# EAGLE schematic DSO_A_AFE_1.66c (EAGLE 7.7.0)

## Sheet 1 of 4
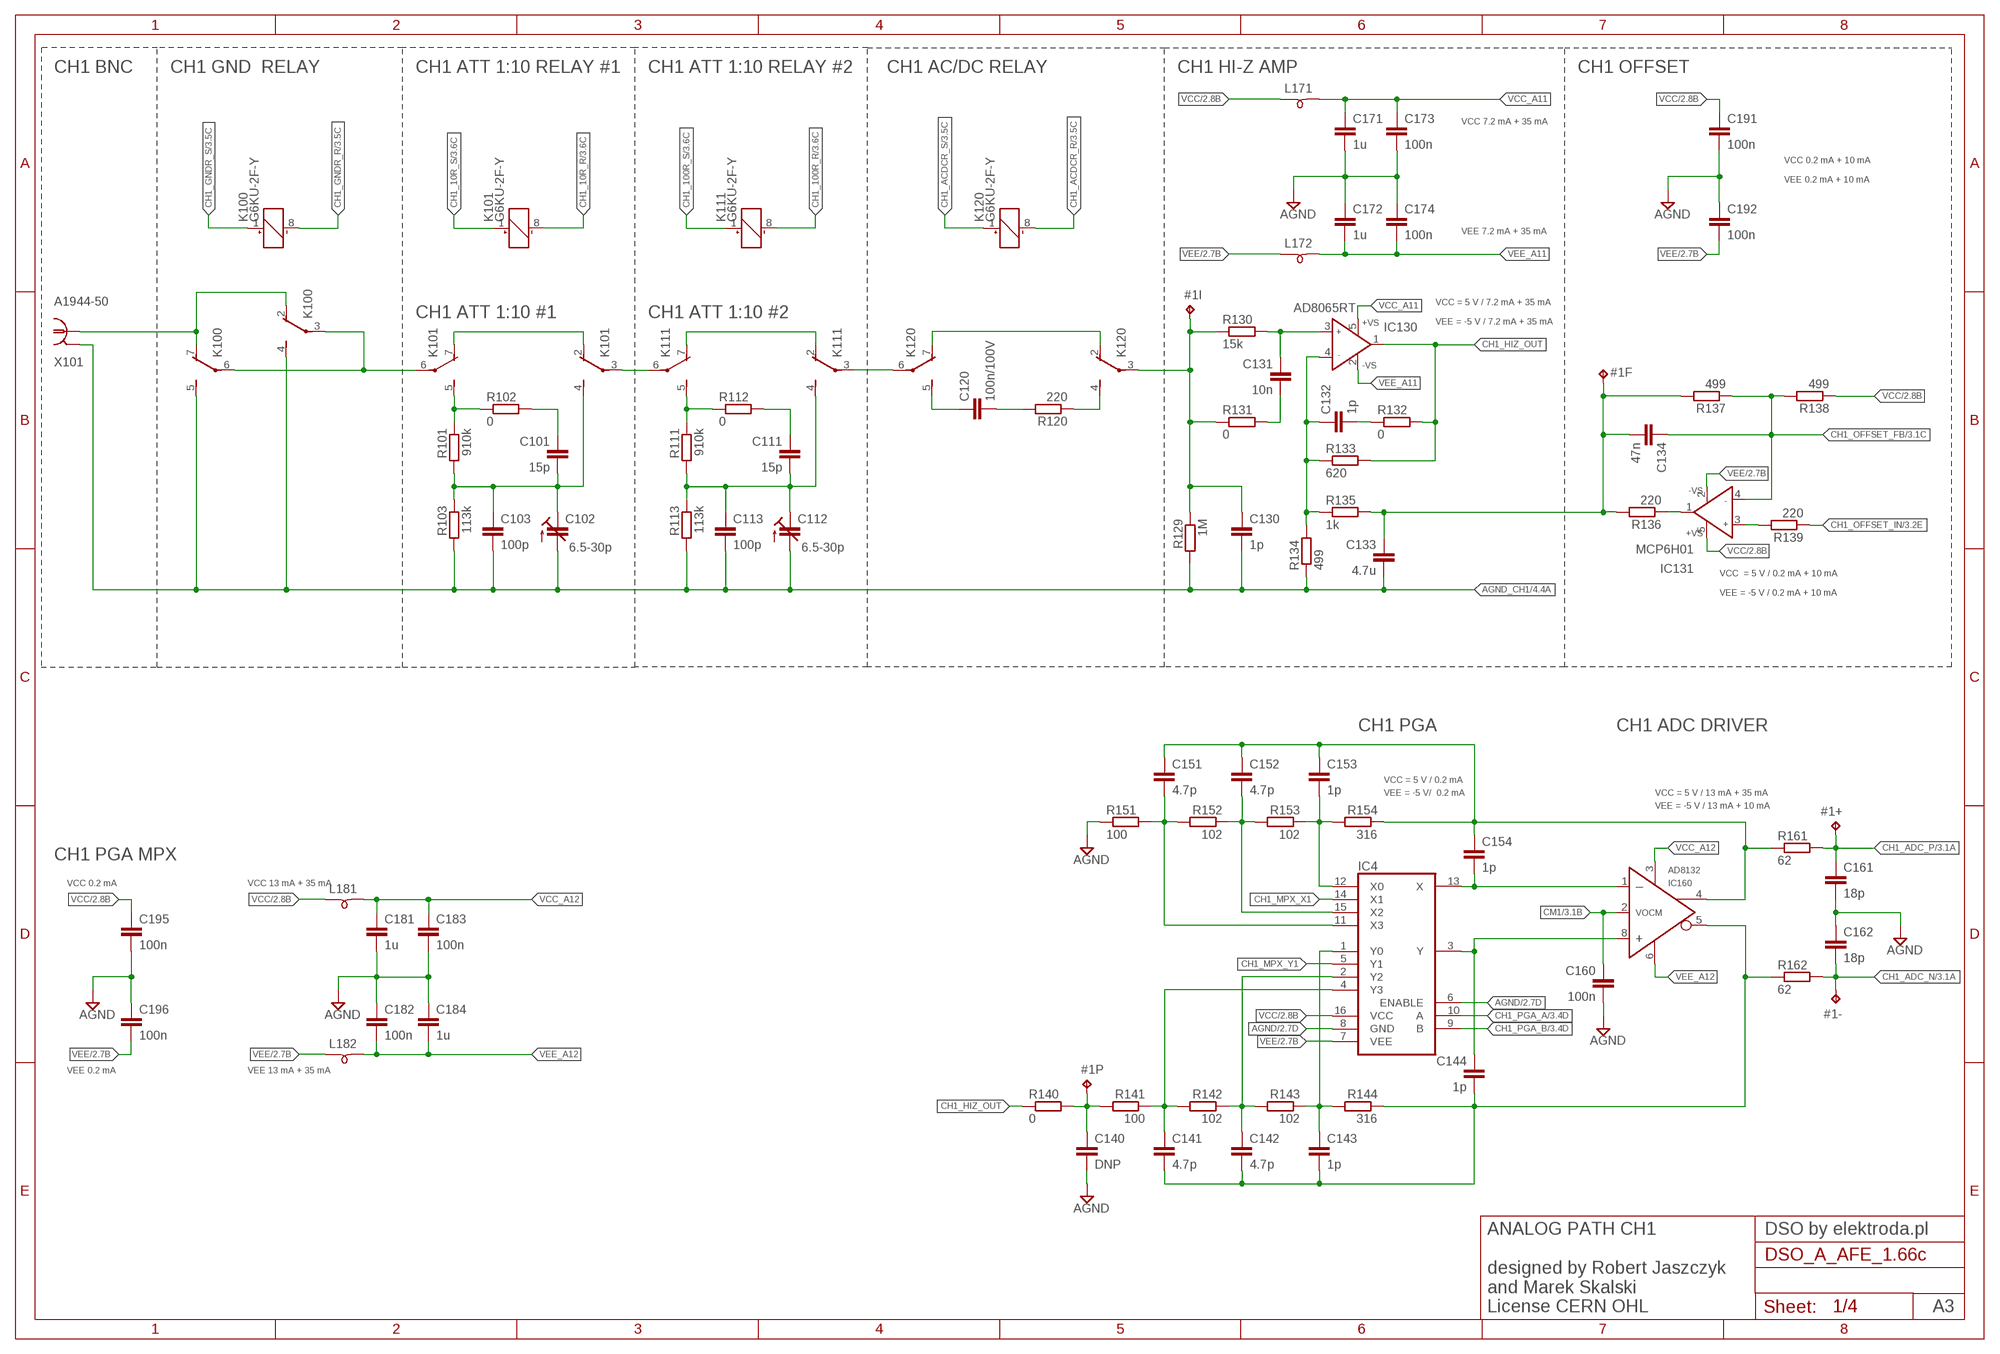
[diagram p0: schematic, sheet 1]

### Parts
#1+  TPB1,27  [B1,27]
#1-  TPB1,27  [B1,27]
#1F  TPB1,27  [B1,27]
#1I  TPB1,27  [B1,27]
#1P  TPB1,27  [B1,27]
C101  15p  C-EUC0603  [C0603]
C102  6.5-30p  C-TRIMMTZBX4  [CTRIMTZBX4]
C103  100p  C-EUC0603  [C0603]
C111  15p  C-EUC0603  [C0603]
C112  6.5-30p  C-TRIMMTZBX4  [CTRIMTZBX4]
C113  100p  C-EUC0603  [C0603]
C120  100n/100V  C-EUC1206  [C1206]
C130  1p  C-EUC0603  [C0603]
C131  10n  C-EUC0603  [C0603]
C132  1p  C-EUC0603  [C0603]
C133  4.7u  C-EUC0603  [C0603]
C134  47n  C-EUC0603  [C0603]
C140  DNP  C-EUC0603  [C0603]
C141  4.7p  C-EUC0603  [C0603]
C142  4.7p  C-EUC0603  [C0603]
C143  1p  C-EUC0603  [C0603]
C144  1p  C-EUC0603  [C0603]
C151  4.7p  C-EUC0603  [C0603]
C152  4.7p  C-EUC0603  [C0603]
C153  1p  C-EUC0603  [C0603]
C154  1p  C-EUC0603  [C0603]
C160  100n  C-EUC0603  [C0603]
C161  18p  C-EUC0603  [C0603]
C162  18p  C-EUC0603  [C0603]
C171  1u  C-EUC0603  [C0603]
C172  1u  C-EUC0603  [C0603]
C173  100n  C-EUC0603  [C0603]
C174  100n  C-EUC0603  [C0603]
C181  1u  C-EUC0603  [C0603]
C182  100n  C-EUC0603  [C0603]
C183  100n  C-EUC0603  [C0603]
C184  1u  C-EUC0603  [C0603]
C191  100n  C-EUC0603  [C0603]
C192  100n  C-EUC0603  [C0603]
C195  100n  C-EUC0603  [C0603]
C196  100n  C-EUC0603  [C0603]
IC4  DG4052EEQ  [TSSOP16]
IC130  AD8065RT  [SOT23-5]
IC131  MCP6H01  AD8065RT  [SOT23-5]
IC160  AD8132  [SO8]
K100  G6KU-2F-Y  [G6KU-2F-Y]
K101  G6KU-2F-Y  [G6KU-2F-Y]
K111  G6KU-2F-Y  [G6KU-2F-Y]
K120  G6KU-2F-Y  [G6KU-2F-Y]
L171  SM-B0603  [0603]
L172  SM-B0603  [0603]
L181  SM-B0603  [0603]
L182  SM-B0603  [0603]
R101  910k  R-EU_R0603  [R0603]
R102  0  R-EU_R0603  [R0603]
R103  113k  R-EU_R0603  [R0603]
R111  910k  R-EU_R0603  [R0603]
R112  0  R-EU_R0603  [R0603]
R113  113k  R-EU_R0603  [R0603]
R120  220  R-EU_R0603  [R0603]
R129  1M  R-EU_R0603  [R0603]
R130  15k  R-EU_R0603  [R0603]
R131  0  R-EU_R0603  [R0603]
R132  0  R-EU_R0603  [R0603]
R133  620  R-EU_R0603  [R0603]
R134  499  R-EU_R0603  [R0603]
R135  1k  R-EU_R0603  [R0603]
R136  220  R-EU_R0603  [R0603]
R137  499  R-EU_R0603  [R0603]
R138  499  R-EU_R0603  [R0603]
R139  220  R-EU_R0603  [R0603]
R140  0  R-EU_R0603  [R0603]
R141  100  R-EU_R0603  [R0603]
R142  102  R-EU_R0603  [R0603]
R143  102  R-EU_R0603  [R0603]
R144  316  R-EU_R0603  [R0603]
R151  100  R-EU_R0603  [R0603]
R152  102  R-EU_R0603  [R0603]
R153  102  R-EU_R0603  [R0603]
R154  316  R-EU_R0603  [R0603]
R161  62  R-EU_R0603  [R0603]
R162  62  R-EU_R0603  [R0603]
X101  A1944-50  [A1944]

### Nets
AGND: C140.2 C160.2 C161.2 C162.1 C171.2 C172.1 C173.2 C174.1 C181.2 C182.1 C183.2 C184.1 C191.2 C192.1 C195.2 C196.1 IC4.6(ENABLE) IC4.8(GND) R151.1 ; also sheet 2,4
AGND_CH1: C102.2(A) C103.2 C112.2(A) C113.2 C130.2 C133.2 K100.4(2:S) K100.5(3:S) R103.2 R113.2 R129.2 R134.1 X101.2 X101.3 X101.4 X101.5 ; also sheet 4
CH1_10R_R: K101.8(1:-) ; also sheet 3
CH1_10R_S: K101.1(1:+) ; also sheet 3
CH1_100R_R: K111.8(1:-) ; also sheet 3
CH1_100R_S: K111.1(1:+) ; also sheet 3
CH1_A1_C: C101.1 R102.2
CH1_A1_IN: K101.5(3:S) R101.1 R102.1
CH1_A1_OUT: C101.2 C102.1(E) C103.1 K101.4(2:S) R101.2 R103.1
CH1_A2_C: C111.1 R112.2
CH1_A2_IN: K111.5(3:S) R111.1 R112.1
CH1_A2_OUT: C111.2 C112.1(E) C113.1 K111.4(2:S) R111.2 R113.1
CH1_AC: C120.2 R120.2
CH1_ACDCR_R: K120.8(1:-) ; also sheet 3
CH1_ACDCR_S: K120.1(1:+) ; also sheet 3
CH1_ACI: C120.1 K120.5(3:S)
CH1_ACO: K120.4(2:S) R120.1
CH1_ADC_N: #1-.TP C162.2 R162.2 ; also sheet 3
CH1_ADC_P: #1+.TP C161.1 R161.2 ; also sheet 3
CH1_GNDR_R: K100.8(1:-) ; also sheet 3
CH1_GNDR_S: K100.1(1:+) ; also sheet 3
CH1_HIZ_IN: #1I.TP C130.1 K120.3(2:P) R129.1 R130.1 R131.1
CH1_HIZ_IN+: C131.1 IC130.3(IN+) R130.2
CH1_HIZ_IN-: C132.1 IC130.4(IN-) R133.1 R134.2 R135.1
CH1_HIZ_OUT: IC130.1(OUT) R132.2 R133.2 R140.1
CH1_IN: K100.2(2:O) K100.7(3:O) X101.1
CH1_IN01: K100.3(2:P) K100.6(3:P) K101.6(3:P)
CH1_IN12: K101.3(2:P) K111.6(3:P)
CH1_IN_HIZ_C: C131.2 R131.2
CH1_INA1: K101.2(2:O) K101.7(3:O)
CH1_INA2: K111.2(2:O) K111.7(3:O)
CH1_INA3: K120.2(2:O) K120.7(3:O)
CH1_INA23: K111.3(2:P) K120.6(3:P)
CH1_MPX_X1: IC4.14(X1)
CH1_MPX_Y1: IC4.5(Y1)
CH1_OFFSET: #1F.TP C133.1 C134.2 R135.2 R136.2 R137.2
CH1_OFFSET_FB: C134.1 IC131.4(IN-) R137.1 R138.2 ; also sheet 3
CH1_OFFSET_IN: R139.1 ; also sheet 3
CH1_OFS_IN+: IC131.3(IN+) R139.2
CH1_OFS_OUT_DIR: IC131.1(OUT) R136.1
CH1_OUT_C: C132.2 R132.1
CH1_PGA_A: IC4.10(A) ; also sheet 3
CH1_PGA_B: IC4.9(B) ; also sheet 3
CH1_PGA_IN: #1P.TP C140.1 R140.2 R141.2
CH1_PGA_IN+: C144.1 IC4.3(Y) IC160.8(+IN)
CH1_PGA_IN-: C154.2 IC4.13(X) IC160.1(-IN)
CH1_PGA_N1: C143.1 IC4.1(Y0) R143.1 R144.2
CH1_PGA_N2: C142.1 IC4.2(Y2) R142.1 R143.2
CH1_PGA_N3: C141.1 IC4.4(Y3) R141.1 R142.2
CH1_PGA_P1: C153.2 IC4.12(X0) R153.1 R154.2
CH1_PGA_P2: C152.2 IC4.15(X2) R152.1 R153.2
CH1_PGA_P3: C151.2 IC4.11(X3) R151.2 R152.2
CH1_PGA_P_DIR: C151.1 C152.1 C153.1 C154.1 IC160.4(+OUT) R154.1 R161.1
CH1_PGAN_DIR: C141.2 C142.2 C143.2 C144.2 IC160.5(-OUT) R144.1 R162.1
CM1: C160.1 IC160.2(VOCM) ; also sheet 3
VCC: C191.1 C195.1 IC4.16(VCC) IC131.5(+VS) L171.1 L181.1 R138.1 ; also sheet 2,3,4
VCC_A11: C171.1 C173.1 IC130.5(+VS) L171.2
VCC_A12: C181.1 C183.1 IC160.3(V+) L181.2
VEE: C192.2 C196.2 IC4.7(VEE) IC131.2(-VS) L172.1 L182.1 ; also sheet 2,4
VEE_A11: C172.2 C174.2 IC130.2(-VS) L172.2
VEE_A12: C182.2 C184.2 IC160.6(V-) L182.2

### Notes on the sheet
- CH1 BNC | CH1 GND  RELAY | CH1 ATT 1:10 RELAY #1 | CH1 ATT 1:10 RELAY #2 | CH1 AC/DC RELAY | CH1 HI-Z AMP | CH1 OFFSET
- VCC 7.2 mA + 35 mA
- VCC 0.2 mA + 10 mA
- VEE 0.2 mA + 10 mA
- VEE 7.2 mA + 35 mA
- VCC = 5 V / 7.2 mA + 35 mA
- CH1 ATT 1:10 #1 | CH1 ATT 1:10 #2
- VEE = -5 V / 7.2 mA + 35 mA
- VCC  = 5 V / 0.2 mA + 10 mA
- VEE = -5 V / 0.2 mA + 10 mA
- CH1 PGA | CH1 ADC DRIVER
- VCC = 5 V / 0.2 mA
- VEE = -5 V/  0.2 mA | VCC = 5 V / 13 mA + 35 mA
- VEE = -5 V / 13 mA + 10 mA
- CH1 PGA MPX
- VCC 0.2 mA | VCC 13 mA + 35 mA
- VEE 0.2 mA | VEE 13 mA + 35 mA
- DSO by elektroda.pl
- ANALOG PATH CH1
  
  designed by Robert Jaszczyk
  and Marek Skalski
  License CERN OHL
- A3

## Sheet 2 of 4
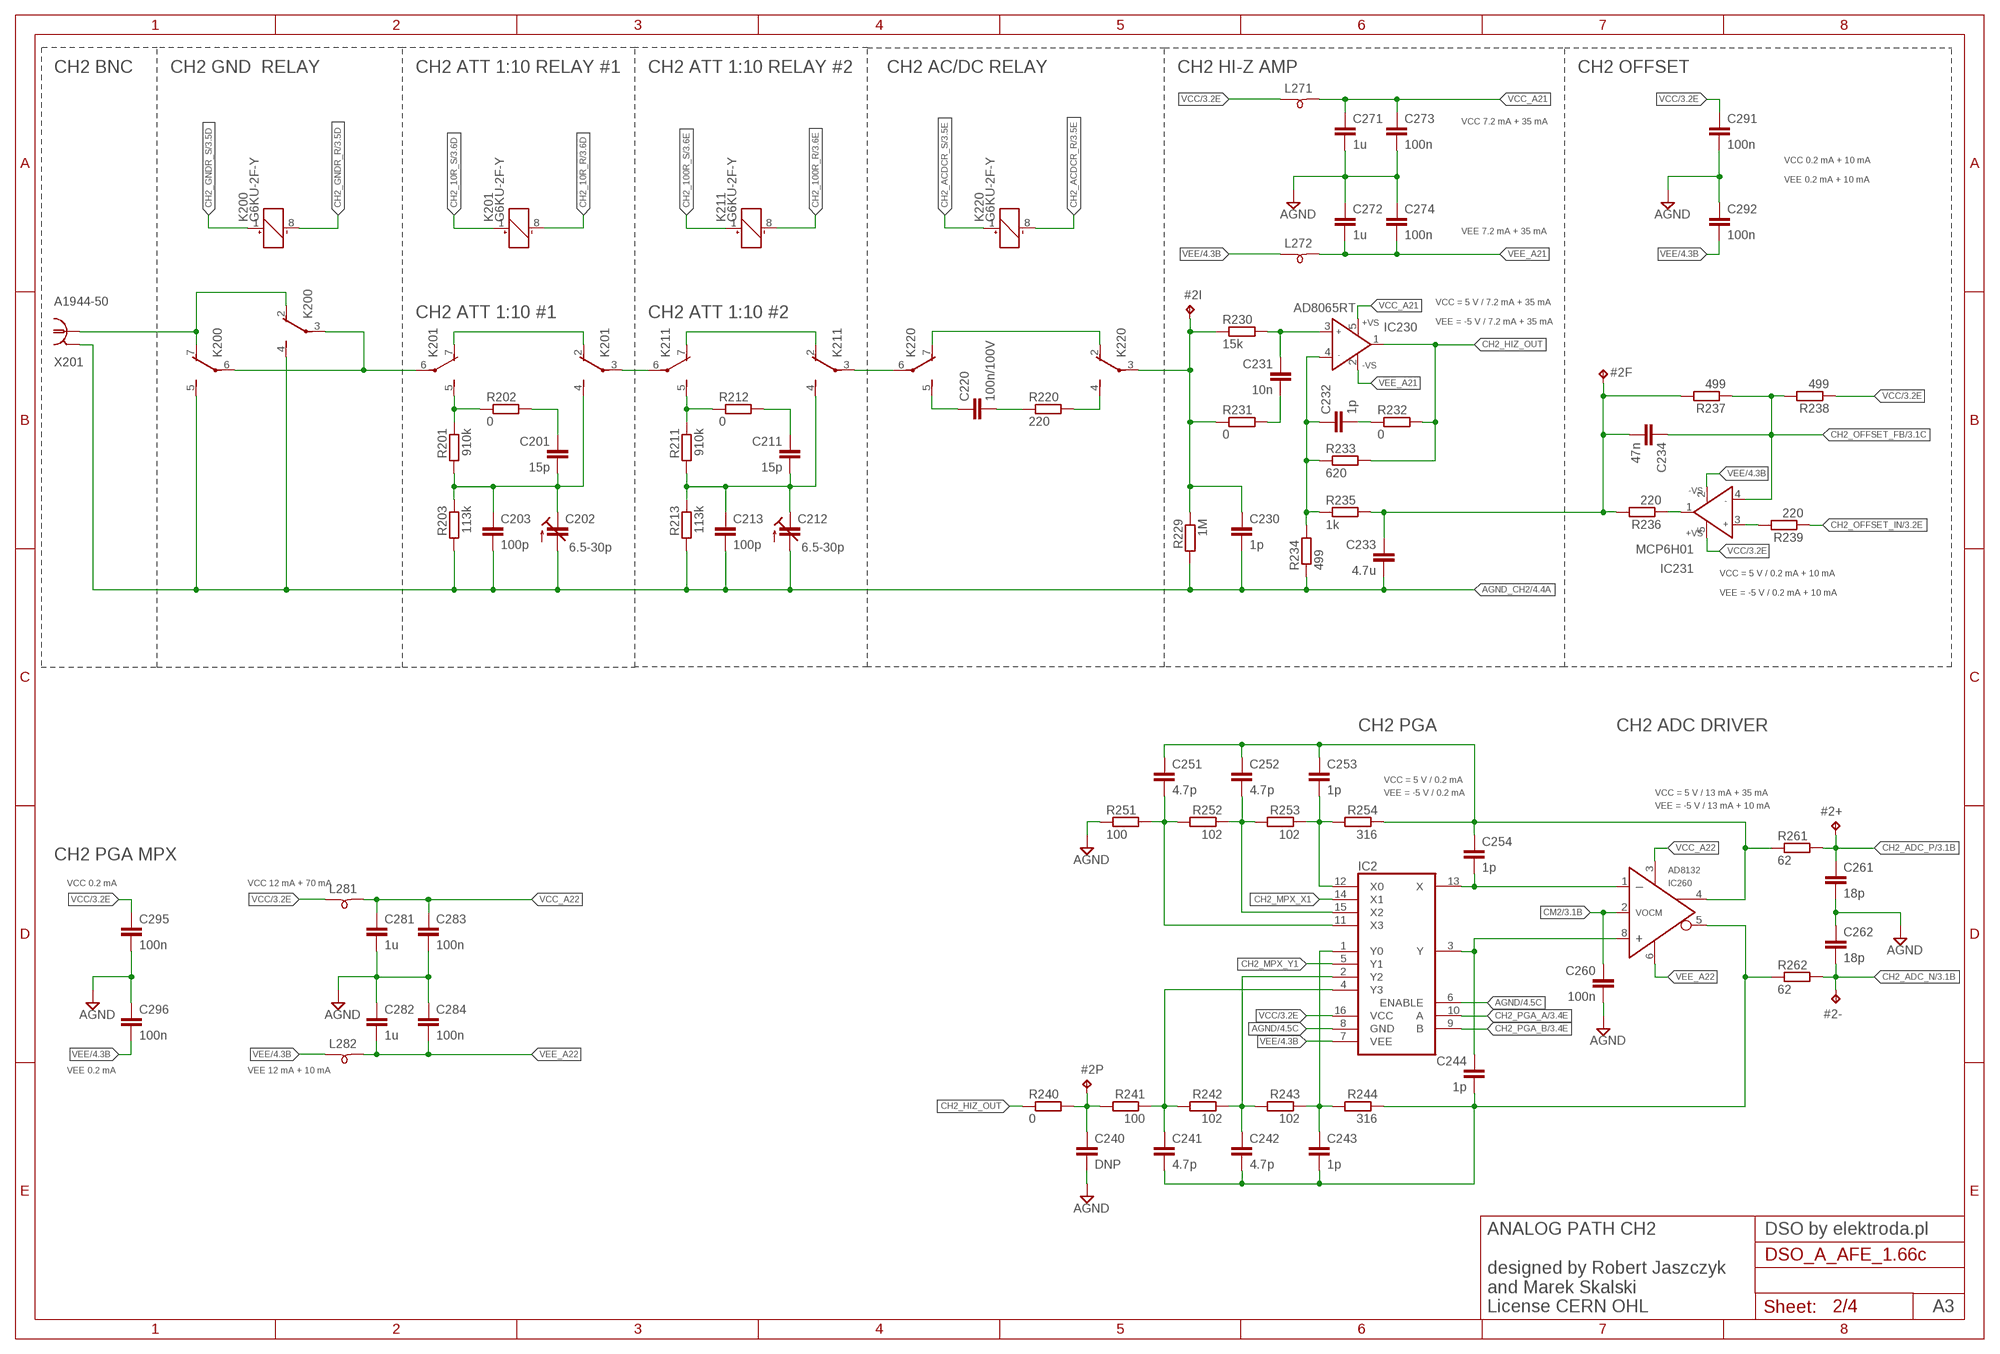
[diagram p1: schematic, sheet 2]

### Parts
#2+  TPB1,27  [B1,27]
#2-  TPB1,27  [B1,27]
#2F  TPB1,27  [B1,27]
#2I  TPB1,27  [B1,27]
#2P  TPB1,27  [B1,27]
C201  15p  C-EUC0603  [C0603]
C202  6.5-30p  C-TRIMMTZBX4  [CTRIMTZBX4]
C203  100p  C-EUC0603  [C0603]
C211  15p  C-EUC0603  [C0603]
C212  6.5-30p  C-TRIMMTZBX4  [CTRIMTZBX4]
C213  100p  C-EUC0603  [C0603]
C220  100n/100V  C-EUC1206  [C1206]
C230  1p  C-EUC0603  [C0603]
C231  10n  C-EUC0603  [C0603]
C232  1p  C-EUC0603  [C0603]
C233  4.7u  C-EUC0603  [C0603]
C234  47n  C-EUC0603  [C0603]
C240  DNP  C-EUC0603  [C0603]
C241  4.7p  C-EUC0603  [C0603]
C242  4.7p  C-EUC0603  [C0603]
C243  1p  C-EUC0603  [C0603]
C244  1p  C-EUC0603  [C0603]
C251  4.7p  C-EUC0603  [C0603]
C252  4.7p  C-EUC0603  [C0603]
C253  1p  C-EUC0603  [C0603]
C254  1p  C-EUC0603  [C0603]
C260  100n  C-EUC0603  [C0603]
C261  18p  C-EUC0603  [C0603]
C262  18p  C-EUC0603  [C0603]
C271  1u  C-EUC0603  [C0603]
C272  1u  C-EUC0603  [C0603]
C273  100n  C-EUC0603  [C0603]
C274  100n  C-EUC0603  [C0603]
C281  1u  C-EUC0603  [C0603]
C282  1u  C-EUC0603  [C0603]
C283  100n  C-EUC0603  [C0603]
C284  100n  C-EUC0603  [C0603]
C291  100n  C-EUC0603  [C0603]
C292  100n  C-EUC0603  [C0603]
C295  100n  C-EUC0603  [C0603]
C296  100n  C-EUC0603  [C0603]
IC2  DG4052EEQ  [TSSOP16]
IC230  AD8065RT  [SOT23-5]
IC231  MCP6H01  AD8065RT  [SOT23-5]
IC260  AD8132  [SO8]
K200  G6KU-2F-Y  [G6KU-2F-Y]
K201  G6KU-2F-Y  [G6KU-2F-Y]
K211  G6KU-2F-Y  [G6KU-2F-Y]
K220  G6KU-2F-Y  [G6KU-2F-Y]
L271  SM-B0603  [0603]
L272  SM-B0603  [0603]
L281  SM-B0603  [0603]
L282  SM-B0603  [0603]
R201  910k  R-EU_R0603  [R0603]
R202  0  R-EU_R0603  [R0603]
R203  113k  R-EU_R0603  [R0603]
R211  910k  R-EU_R0603  [R0603]
R212  0  R-EU_R0603  [R0603]
R213  113k  R-EU_R0603  [R0603]
R220  220  R-EU_R0603  [R0603]
R229  1M  R-EU_R0603  [R0603]
R230  15k  R-EU_R0603  [R0603]
R231  0  R-EU_R0603  [R0603]
R232  0  R-EU_R0603  [R0603]
R233  620  R-EU_R0603  [R0603]
R234  499  R-EU_R0603  [R0603]
R235  1k  R-EU_R0603  [R0603]
R236  220  R-EU_R0603  [R0603]
R237  499  R-EU_R0603  [R0603]
R238  499  R-EU_R0603  [R0603]
R239  220  R-EU_R0603  [R0603]
R240  0  R-EU_R0603  [R0603]
R241  100  R-EU_R0603  [R0603]
R242  102  R-EU_R0603  [R0603]
R243  102  R-EU_R0603  [R0603]
R244  316  R-EU_R0603  [R0603]
R251  100  R-EU_R0603  [R0603]
R252  102  R-EU_R0603  [R0603]
R253  102  R-EU_R0603  [R0603]
R254  316  R-EU_R0603  [R0603]
R261  62  R-EU_R0603  [R0603]
R262  62  R-EU_R0603  [R0603]
X201  A1944-50  [A1944]

### Nets
AGND: C240.2 C260.2 C261.2 C262.1 C271.2 C272.1 C273.2 C274.1 C281.2 C282.1 C283.2 C284.1 C291.2 C292.1 C295.2 C296.1 IC2.6(ENABLE) IC2.8(GND) R251.1 ; also sheet 1,4
AGND_CH2: C202.2(A) C203.2 C212.2(A) C213.2 C230.2 C233.2 K200.4(2:S) K200.5(3:S) R203.2 R213.2 R229.2 R234.1 X201.2 X201.3 X201.4 X201.5 ; also sheet 4
CH1_OFS_OUT_DIR1: IC231.1(OUT) R236.1
CH2_10R_R: K201.8(1:-) ; also sheet 3
CH2_10R_S: K201.1(1:+) ; also sheet 3
CH2_100R_R: K211.8(1:-) ; also sheet 3
CH2_100R_S: K211.1(1:+) ; also sheet 3
CH2_A1_C: C201.1 R202.2
CH2_A1_IN: K201.5(3:S) R201.1 R202.1
CH2_A1_OUT: C201.2 C202.1(E) C203.1 K201.4(2:S) R201.2 R203.1
CH2_A2_C: C211.1 R212.2
CH2_A2_IN: K211.5(3:S) R211.1 R212.1
CH2_A2_OUT: C211.2 C212.1(E) C213.1 K211.4(2:S) R211.2 R213.1
CH2_AC: C220.2 R220.1
CH2_ACDCR_R: K220.8(1:-) ; also sheet 3
CH2_ACDCR_S: K220.1(1:+) ; also sheet 3
CH2_ACI: C220.1 K220.5(3:S)
CH2_ACO: K220.4(2:S) R220.2
CH2_ADC_N: #2-.TP C262.2 R262.2 ; also sheet 3
CH2_ADC_P: #2+.TP C261.1 R261.2 ; also sheet 3
CH2_GNDR_R: K200.8(1:-) ; also sheet 3
CH2_GNDR_S: K200.1(1:+) ; also sheet 3
CH2_HIZ_IN: #2I.TP C230.1 K220.3(2:P) R229.1 R230.1 R231.1
CH2_HIZ_IN+: C231.1 IC230.3(IN+) R230.2
CH2_HIZ_IN-: C232.1 IC230.4(IN-) R233.1 R234.2 R235.1
CH2_HIZ_OUT: IC230.1(OUT) R232.2 R233.2 R240.1
CH2_IN: K200.2(2:O) K200.7(3:O) X201.1
CH2_IN01: K200.3(2:P) K200.6(3:P) K201.6(3:P)
CH2_IN12: K201.3(2:P) K211.6(3:P)
CH2_IN_HIZ_C: C231.2 R231.2
CH2_INA1: K201.2(2:O) K201.7(3:O)
CH2_INA2: K211.2(2:O) K211.7(3:O)
CH2_INA3: K220.2(2:O) K220.7(3:O)
CH2_INA23: K211.3(2:P) K220.6(3:P)
CH2_MPX_X1: IC2.14(X1)
CH2_MPX_Y1: IC2.5(Y1)
CH2_OFFSET: #2F.TP C233.1 C234.2 R235.2 R236.2 R237.2
CH2_OFFSET_FB: C234.1 IC231.4(IN-) R237.1 R238.2 ; also sheet 3
CH2_OFFSET_IN: R239.1 ; also sheet 3
CH2_OFS_IN+: IC231.3(IN+) R239.2
CH2_OUT_C: C232.2 R232.1
CH2_PGA_A: IC2.10(A) ; also sheet 3
CH2_PGA_B: IC2.9(B) ; also sheet 3
CH2_PGA_IN1: #2P.TP C240.1 R240.2 R241.2
CH2_PGA_IN+: C244.1 IC2.3(Y) IC260.8(+IN)
CH2_PGA_IN-: C254.2 IC2.13(X) IC260.1(-IN)
CH2_PGA_N1: C243.1 IC2.1(Y0) R243.1 R244.2
CH2_PGA_N2: C242.1 IC2.2(Y2) R242.1 R243.2
CH2_PGA_N5: C241.1 IC2.4(Y3) R241.1 R242.2
CH2_PGA_P1: C253.2 IC2.12(X0) R253.1 R254.2
CH2_PGA_P2: C252.2 IC2.15(X2) R252.1 R253.2
CH2_PGA_P5: C251.2 IC2.11(X3) R251.2 R252.2
CH2_PGA_P_DIR: C251.1 C252.1 C253.1 C254.1 IC260.4(+OUT) R254.1 R261.1
CH2_PGAN_DIR: C241.2 C242.2 C243.2 C244.2 IC260.5(-OUT) R244.1 R262.1
CM2: C260.1 IC260.2(VOCM) ; also sheet 3
VCC: C291.1 C295.1 IC2.16(VCC) IC231.5(+VS) L271.1 L281.1 R238.1 ; also sheet 1,3,4
VCC_A21: C271.1 C273.1 IC230.5(+VS) L271.2
VCC_A22: C281.1 C283.1 IC260.3(V+) L281.2
VEE: C292.2 C296.2 IC2.7(VEE) IC231.2(-VS) L272.1 L282.1 ; also sheet 1,4
VEE_A21: C272.2 C274.2 IC230.2(-VS) L272.2
VEE_A22: C282.2 C284.2 IC260.6(V-) L282.2

### Notes on the sheet
- CH2 BNC | CH2 GND  RELAY | CH2 ATT 1:10 RELAY #1 | CH2 ATT 1:10 RELAY #2 | CH2 AC/DC RELAY | CH2 HI-Z AMP | CH2 OFFSET
- VCC 7.2 mA + 35 mA
- VCC 0.2 mA + 10 mA
- VEE 0.2 mA + 10 mA
- VEE 7.2 mA + 35 mA
- VCC = 5 V / 7.2 mA + 35 mA
- CH2 ATT 1:10 #1 | CH2 ATT 1:10 #2
- VEE = -5 V / 7.2 mA + 35 mA
- VCC = 5 V / 0.2 mA + 10 mA
- VEE = -5 V / 0.2 mA + 10 mA
- CH2 PGA | CH2 ADC DRIVER
- VCC = 5 V / 0.2 mA
- VEE = -5 V / 0.2 mA | VCC = 5 V / 13 mA + 35 mA
- VEE = -5 V / 13 mA + 10 mA
- CH2 PGA MPX
- VCC 0.2 mA | VCC 12 mA + 70 mA
- VEE 0.2 mA | VEE 12 mA + 10 mA
- DSO by elektroda.pl
- ANALOG PATH CH2
  
  designed by Robert Jaszczyk
  and Marek Skalski
  License CERN OHL
- A3

## Sheet 3 of 4
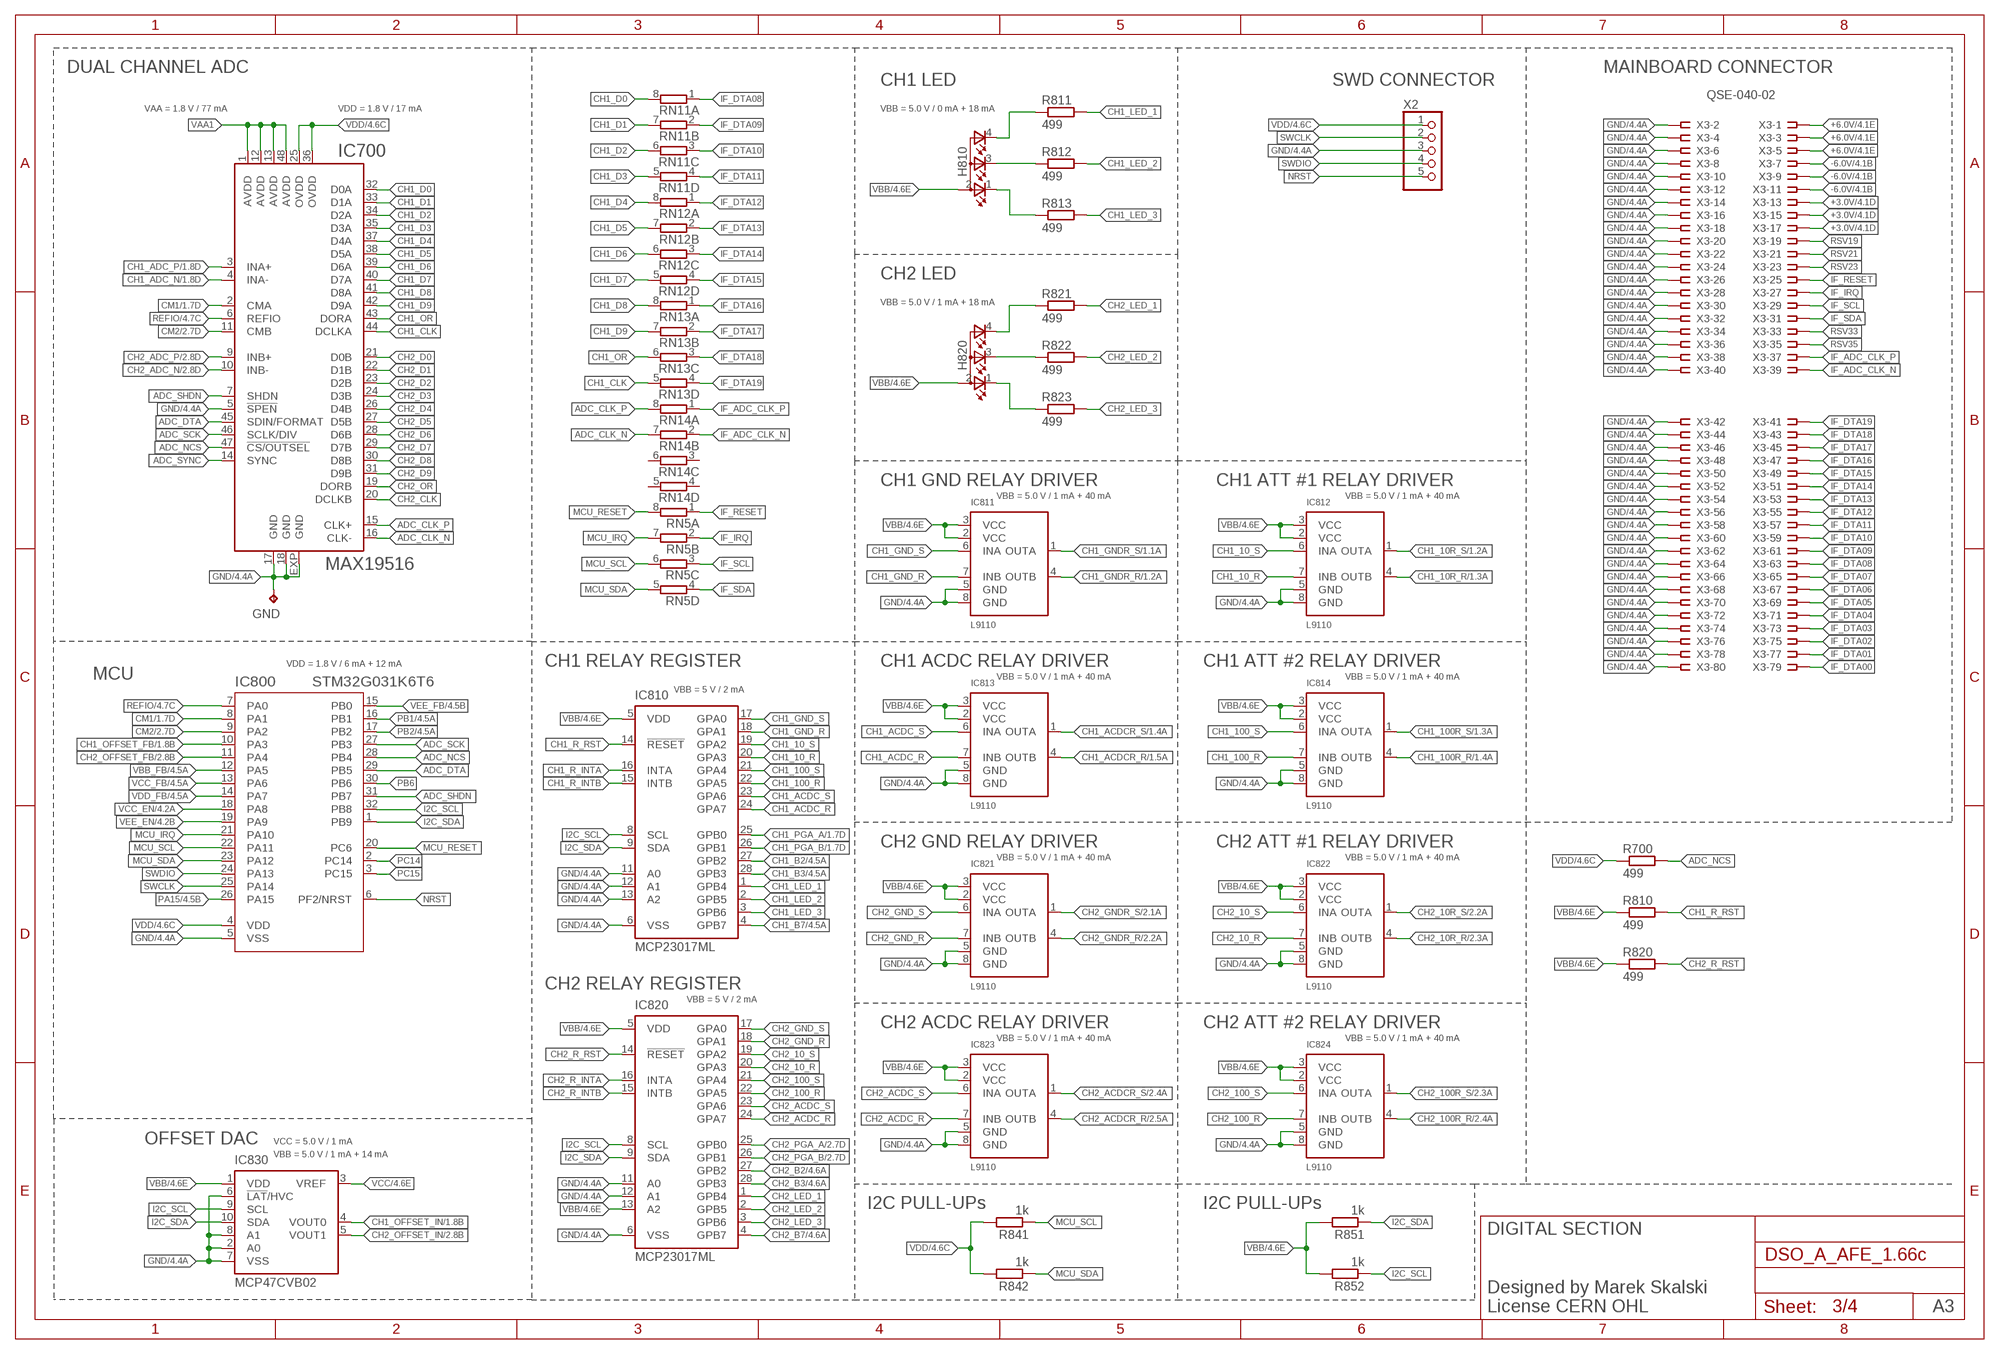
[diagram p2: schematic, sheet 3]

### Parts
GND  TPB1,27  [B1,27]
H810  CREE_PLCC4_RGB  [PLCC4_CREE]
H820  CREE_PLCC4_RGB  [PLCC4_CREE]
IC700  MAX19516  MAX19516ETM+  [TQFN48-EP]
IC800  STM32G031K6T6  STM32G031T6  [LQFP32_7X7]
IC810  MCP23017ML  [QFN28-ML_6X6MM]
IC811  L9110  [SO08]
IC812  L9110  [SO08]
IC813  L9110  [SO08]
IC814  L9110  [SO08]
IC820  MCP23017ML  [QFN28-ML_6X6MM]
IC821  L9110  [SO08]
IC822  L9110  [SO08]
IC823  L9110  [SO08]
IC824  L9110  [SO08]
IC830  MCP47CVB02  MCP47CVBX2""  [MSOP10]
R700  499  R-EU_R0603  [R0603]
R810  499  R-EU_R0603  [R0603]
R811  499  R-EU_R0603  [R0603]
R812  499  R-EU_R0603  [R0603]
R813  499  R-EU_R0603  [R0603]
R820  499  R-EU_R0603  [R0603]
R821  499  R-EU_R0603  [R0603]
R822  499  R-EU_R0603  [R0603]
R823  499  R-EU_R0603  [R0603]
R841  1k  R-EU_R0603  [R0603]
R842  1k  R-EU_R0603  [R0603]
R851  1k  R-EU_R0603  [R0603]
R852  1k  R-EU_R0603  [R0603]
RN5  4R-N0603-ARC  [0603-ARC]
RN11  4R-N0603-ARC  [0603-ARC]
RN12  4R-N0603-ARC  [0603-ARC]
RN13  4R-N0603-ARC  [0603-ARC]
RN14  4R-N0603-ARC  [0603-ARC]
X2  PINHD-1X5/90  [1X05/90]
X3  QSE-040-02  [QSE-040-02]

### Nets
+3.0V: X3.13 X3.15 X3.17 ; also sheet 4
+6.0V: X3.1 X3.3 X3.5 ; also sheet 4
-6.0V: X3.7 X3.9 X3.11 ; also sheet 4
ADC_CLK_N: IC700.16(CLK-) RN14.7
ADC_CLK_P: IC700.15(CLK+) RN14.8
ADC_DTA: IC700.45(SDIN/FORMAT) IC800.29(PB5)
ADC_NCS: IC700.47(!CS/OUTSEL) IC800.28(PB4) R700.2
ADC_SCK: IC700.46(SCLK/DIV) IC800.27(PB3)
ADC_SHDN: IC700.7(SHDN) IC800.31(PB7)
ADC_SYNC: IC700.14(SYNC)
CH1_10_R: IC810.20(GPA3) IC812.7(INB)
CH1_10_S: IC810.19(GPA2) IC812.6(INA)
CH1_10R_R: IC812.4(OUTB) ; also sheet 1
CH1_10R_S: IC812.1(OUTA) ; also sheet 1
CH1_100_R: IC810.22(GPA5) IC814.7(INB)
CH1_100_S: IC810.21(GPA4) IC814.6(INA)
CH1_100R_R: IC814.4(OUTB) ; also sheet 1
CH1_100R_S: IC814.1(OUTA) ; also sheet 1
CH1_ACDC_R: IC810.24(GPA7) IC813.7(INB)
CH1_ACDC_S: IC810.23(GPA6) IC813.6(INA)
CH1_ACDCR_R: IC813.4(OUTB) ; also sheet 1
CH1_ACDCR_S: IC813.1(OUTA) ; also sheet 1
CH1_ADC_N: IC700.4(INA-) ; also sheet 1
CH1_ADC_P: IC700.3(INA+) ; also sheet 1
CH1_B2: IC810.27(GPB2) ; also sheet 4
CH1_B3: IC810.28(GPB3) ; also sheet 4
CH1_B7: IC810.4(GPB7) ; also sheet 4
CH1_CLK: IC700.44(DCLKA) RN13.5
CH1_D0: IC700.32(D0A) RN11.8
CH1_D1: IC700.33(D1A) RN11.7
CH1_D2: IC700.34(D2A) RN11.6
CH1_D3: IC700.35(D3A) RN11.5
CH1_D4: IC700.37(D4A) RN12.8
CH1_D5: IC700.38(D5A) RN12.7
CH1_D6: IC700.39(D6A) RN12.6
CH1_D7: IC700.40(D7A) RN12.5
CH1_D8: IC700.41(D8A) RN13.8
CH1_D9: IC700.42(D9A) RN13.7
CH1_GND_R: IC810.18(GPA1) IC811.7(INB)
CH1_GND_S: IC810.17(GPA0) IC811.6(INA)
CH1_GNDR_R: IC811.4(OUTB) ; also sheet 1
CH1_GNDR_S: IC811.1(OUTA) ; also sheet 1
CH1_LED1: H810.4(CGREEN) R811.1
CH1_LED2: H810.3(CBLUE) R812.1
CH1_LED3: H810.1(CRED) R813.1
CH1_LED_1: IC810.1(GPB4) R811.2
CH1_LED_2: IC810.2(GPB5) R812.2
CH1_LED_3: IC810.3(GPB6) R813.2
CH1_OFFSET_FB: IC800.10(PA3) ; also sheet 1
CH1_OFFSET_IN: IC830.4(VOUT0) ; also sheet 1
CH1_OR: IC700.43(DORA) RN13.6
CH1_PGA_A: IC810.25(GPB0) ; also sheet 1
CH1_PGA_B: IC810.26(GPB1) ; also sheet 1
CH1_R_INTA: IC810.16(INTA)
CH1_R_INTB: IC810.15(INTB)
CH1_R_RST: IC810.14(!RESET) R810.2
CH2_10_R: IC820.20(GPA3) IC822.7(INB)
CH2_10_S: IC820.19(GPA2) IC822.6(INA)
CH2_10R_R: IC822.4(OUTB) ; also sheet 2
CH2_10R_S: IC822.1(OUTA) ; also sheet 2
CH2_100_R: IC820.22(GPA5) IC824.7(INB)
CH2_100_S: IC820.21(GPA4) IC824.6(INA)
CH2_100R_R: IC824.4(OUTB) ; also sheet 2
CH2_100R_S: IC824.1(OUTA) ; also sheet 2
CH2_ACDC_R: IC820.24(GPA7) IC823.7(INB)
CH2_ACDC_S: IC820.23(GPA6) IC823.6(INA)
CH2_ACDCR_R: IC823.4(OUTB) ; also sheet 2
CH2_ACDCR_S: IC823.1(OUTA) ; also sheet 2
CH2_ADC_N: IC700.10(INB-) ; also sheet 2
CH2_ADC_P: IC700.9(INB+) ; also sheet 2
CH2_B2: IC820.27(GPB2) ; also sheet 4
CH2_B3: IC820.28(GPB3) ; also sheet 4
CH2_B7: IC820.4(GPB7) ; also sheet 4
CH2_CLK: IC700.20(DCLKB)
CH2_D0: IC700.21(D0B)
CH2_D1: IC700.22(D1B)
CH2_D2: IC700.23(D2B)
CH2_D3: IC700.24(D3B)
CH2_D4: IC700.26(D4B)
CH2_D5: IC700.27(D5B)
CH2_D6: IC700.28(D6B)
CH2_D7: IC700.29(D7B)
CH2_D8: IC700.30(D8B)
CH2_D9: IC700.31(D9B)
CH2_GND_R: IC820.18(GPA1) IC821.7(INB)
CH2_GND_S: IC820.17(GPA0) IC821.6(INA)
CH2_GNDR_R: IC821.4(OUTB) ; also sheet 2
CH2_GNDR_S: IC821.1(OUTA) ; also sheet 2
CH2_LED1: H820.4(CGREEN) R821.1
CH2_LED2: H820.3(CBLUE) R822.1
CH2_LED3: H820.1(CRED) R823.1
CH2_LED_1: IC820.1(GPB4) R821.2
CH2_LED_2: IC820.2(GPB5) R822.2
CH2_LED_3: IC820.3(GPB6) R823.2
CH2_OFFSET_FB: IC800.11(PA4) ; also sheet 2
CH2_OFFSET_IN: IC830.5(VOUT1) ; also sheet 2
CH2_OR: IC700.19(DORB)
CH2_PGA_A: IC820.25(GPB0) ; also sheet 2
CH2_PGA_B: IC820.26(GPB1) ; also sheet 2
CH2_R_INTA: IC820.16(INTA)
CH2_R_INTB: IC820.15(INTB)
CH2_R_RST: IC820.14(!RESET) R820.2
CM1: IC700.2(CMA) IC800.8(PA1) ; also sheet 1
CM2: IC700.11(CMB) IC800.9(PA2) ; also sheet 2
GND: GND.TP IC700.5(!SPEN) IC700.17(GND) IC700.18(GND) IC700.EXP(GND) IC800.5(VSS) IC810.6(VSS) IC810.11(A0) IC810.12(A1) IC810.13(A2) IC811.5(GND) IC811.8(GND) IC812.5(GND) IC812.8(GND) IC813.5(GND) IC813.8(GND) IC814.5(GND) IC814.8(GND) IC820.6(VSS) IC820.11(A0) IC820.12(A1) IC821.5(GND) IC821.8(GND) IC822.5(GND) IC822.8(GND) IC823.5(GND) IC823.8(GND) IC824.5(GND) IC824.8(GND) IC830.2(A0) IC830.6(!LAT!/HVC) IC830.7(VSS) IC830.8(A1) X2.3 X3.2 X3.4 X3.6 X3.8 X3.10 X3.12 X3.14 X3.16 X3.18 X3.20 X3.22 X3.24 X3.26 X3.28 X3.30 X3.32 X3.34 X3.36 X3.38 X3.40 X3.42 X3.44 X3.46 X3.48 X3.50 X3.52 X3.54 X3.56 X3.58 X3.60 X3.62 X3.64 X3.66 X3.68 X3.70 X3.72 X3.74 X3.76 X3.78 X3.80 ; also sheet 4
I2C_SCL: IC800.32(PB8) IC810.8(SCL) IC820.8(SCL) IC830.9(SCL) R852.1
I2C_SDA: IC800.1(PB9) IC810.9(SDA) IC820.9(SDA) IC830.10(SDA) R851.1
IF_ADC_CLK_N: RN14.2 X3.39
IF_ADC_CLK_P: RN14.1 X3.37
IF_DTA00: X3.79
IF_DTA01: X3.77
IF_DTA02: X3.75
IF_DTA03: X3.73
IF_DTA04: X3.71
IF_DTA05: X3.69
IF_DTA06: X3.67
IF_DTA07: X3.65
IF_DTA08: RN11.1 X3.63
IF_DTA09: RN11.2 X3.61
IF_DTA10: RN11.3 X3.59
IF_DTA11: RN11.4 X3.57
IF_DTA12: RN12.1 X3.55
IF_DTA13: RN12.2 X3.53
IF_DTA14: RN12.3 X3.51
IF_DTA15: RN12.4 X3.49
IF_DTA16: RN13.1 X3.47
IF_DTA17: RN13.2 X3.45
IF_DTA18: RN13.3 X3.43
IF_DTA19: RN13.4 X3.41
IF_IRQ: RN5.2 X3.27
IF_RESET: RN5.1 X3.25
IF_SCL: RN5.3 X3.29
IF_SDA: RN5.4 X3.31
MCU_IRQ: IC800.21(PA10) RN5.7
MCU_RESET: IC800.20(PC6) RN5.8
MCU_SCL: IC800.22(PA11) R841.1 RN5.6
MCU_SDA: IC800.23(PA12) R842.1 RN5.5
NRST: IC800.6(PF2/NRST) X2.5
PA15: IC800.26(PA15) ; also sheet 4
PB1: IC800.16(PB1) ; also sheet 4
PB2: IC800.17(PB2) ; also sheet 4
PB6: IC800.30(PB6)
PC14: IC800.2(PC14)
PC15: IC800.3(PC15)
REFIO: IC700.6(REFIO) IC800.7(PA0) ; also sheet 4
RSV19: X3.19
RSV21: X3.21
RSV23: X3.23
RSV33: X3.33
RSV35: X3.35
SWCLK: IC800.25(PA14) X2.2
SWDIO: IC800.24(PA13) X2.4
VAA1: IC700.1(AVDD) IC700.12(AVDD) IC700.13(AVDD) IC700.48(AVDD) ; also sheet 4
VBB: H810.2(A3) H820.2(A3) IC810.5(VDD) IC811.2(VCC) IC811.3(VCC) IC812.2(VCC) IC812.3(VCC) IC813.2(VCC) IC813.3(VCC) IC814.2(VCC) IC814.3(VCC) IC820.5(VDD) IC820.13(A2) IC821.2(VCC) IC821.3(VCC) IC822.2(VCC) IC822.3(VCC) IC823.2(VCC) IC823.3(VCC) IC824.2(VCC) IC824.3(VCC) IC830.1(VDD) R810.1 R820.1 R851.2 R852.2 ; also sheet 4
VBB_FB: IC800.12(PA5) ; also sheet 4
VCC: IC830.3(VREF) ; also sheet 1,2,4
VCC_EN: IC800.18(PA8) ; also sheet 4
VCC_FB: IC800.13(PA6) ; also sheet 4
VDD: IC700.25(OVDD) IC700.36(OVDD) IC800.4(VDD) R700.1 R841.2 R842.2 X2.1 ; also sheet 4
VDD_FB: IC800.14(PA7) ; also sheet 4
VEE_EN: IC800.19(PA9) ; also sheet 4
VEE_FB: IC800.15(PB0) ; also sheet 4
Unconnected: RN14.3 RN14.4 RN14.5 RN14.6

### Notes on the sheet
- DUAL CHANNEL ADC | MAINBOARD CONNECTOR
- CH1 LED | SWD CONNECTOR
- VAA = 1.8 V / 77 mA | VDD = 1.8 V / 17 mA | VBB = 5.0 V / 0 mA + 18 mA
- CH2 LED
- VBB = 5.0 V / 1 mA + 18 mA
- CH1 GND RELAY DRIVER | CH1 ATT #1 RELAY DRIVER
- VBB = 5.0 V / 1 mA + 40 mA | VBB = 5.0 V / 1 mA + 40 mA
- VDD = 1.8 V / 6 mA + 12 mA | CH1 RELAY REGISTER | CH1 ACDC RELAY DRIVER | CH1 ATT #2 RELAY DRIVER
- MCU | VBB = 5.0 V / 1 mA + 40 mA | VBB = 5.0 V / 1 mA + 40 mA
- VBB = 5 V / 2 mA
- CH2 GND RELAY DRIVER | CH2 ATT #1 RELAY DRIVER
- VBB = 5.0 V / 1 mA + 40 mA | VBB = 5.0 V / 1 mA + 40 mA
- CH2 RELAY REGISTER
- VBB = 5 V / 2 mA
- CH2 ACDC RELAY DRIVER | CH2 ATT #2 RELAY DRIVER
- VBB = 5.0 V / 1 mA + 40 mA | VBB = 5.0 V / 1 mA + 40 mA
- OFFSET DAC | VCC = 5.0 V / 1 mA
- VBB = 5.0 V / 1 mA + 14 mA
- I2C PULL-UPs | I2C PULL-UPs
- DIGITAL SECTION
  
  
  Designed by Marek Skalski
  License CERN OHL
- A3

## Sheet 4 of 4
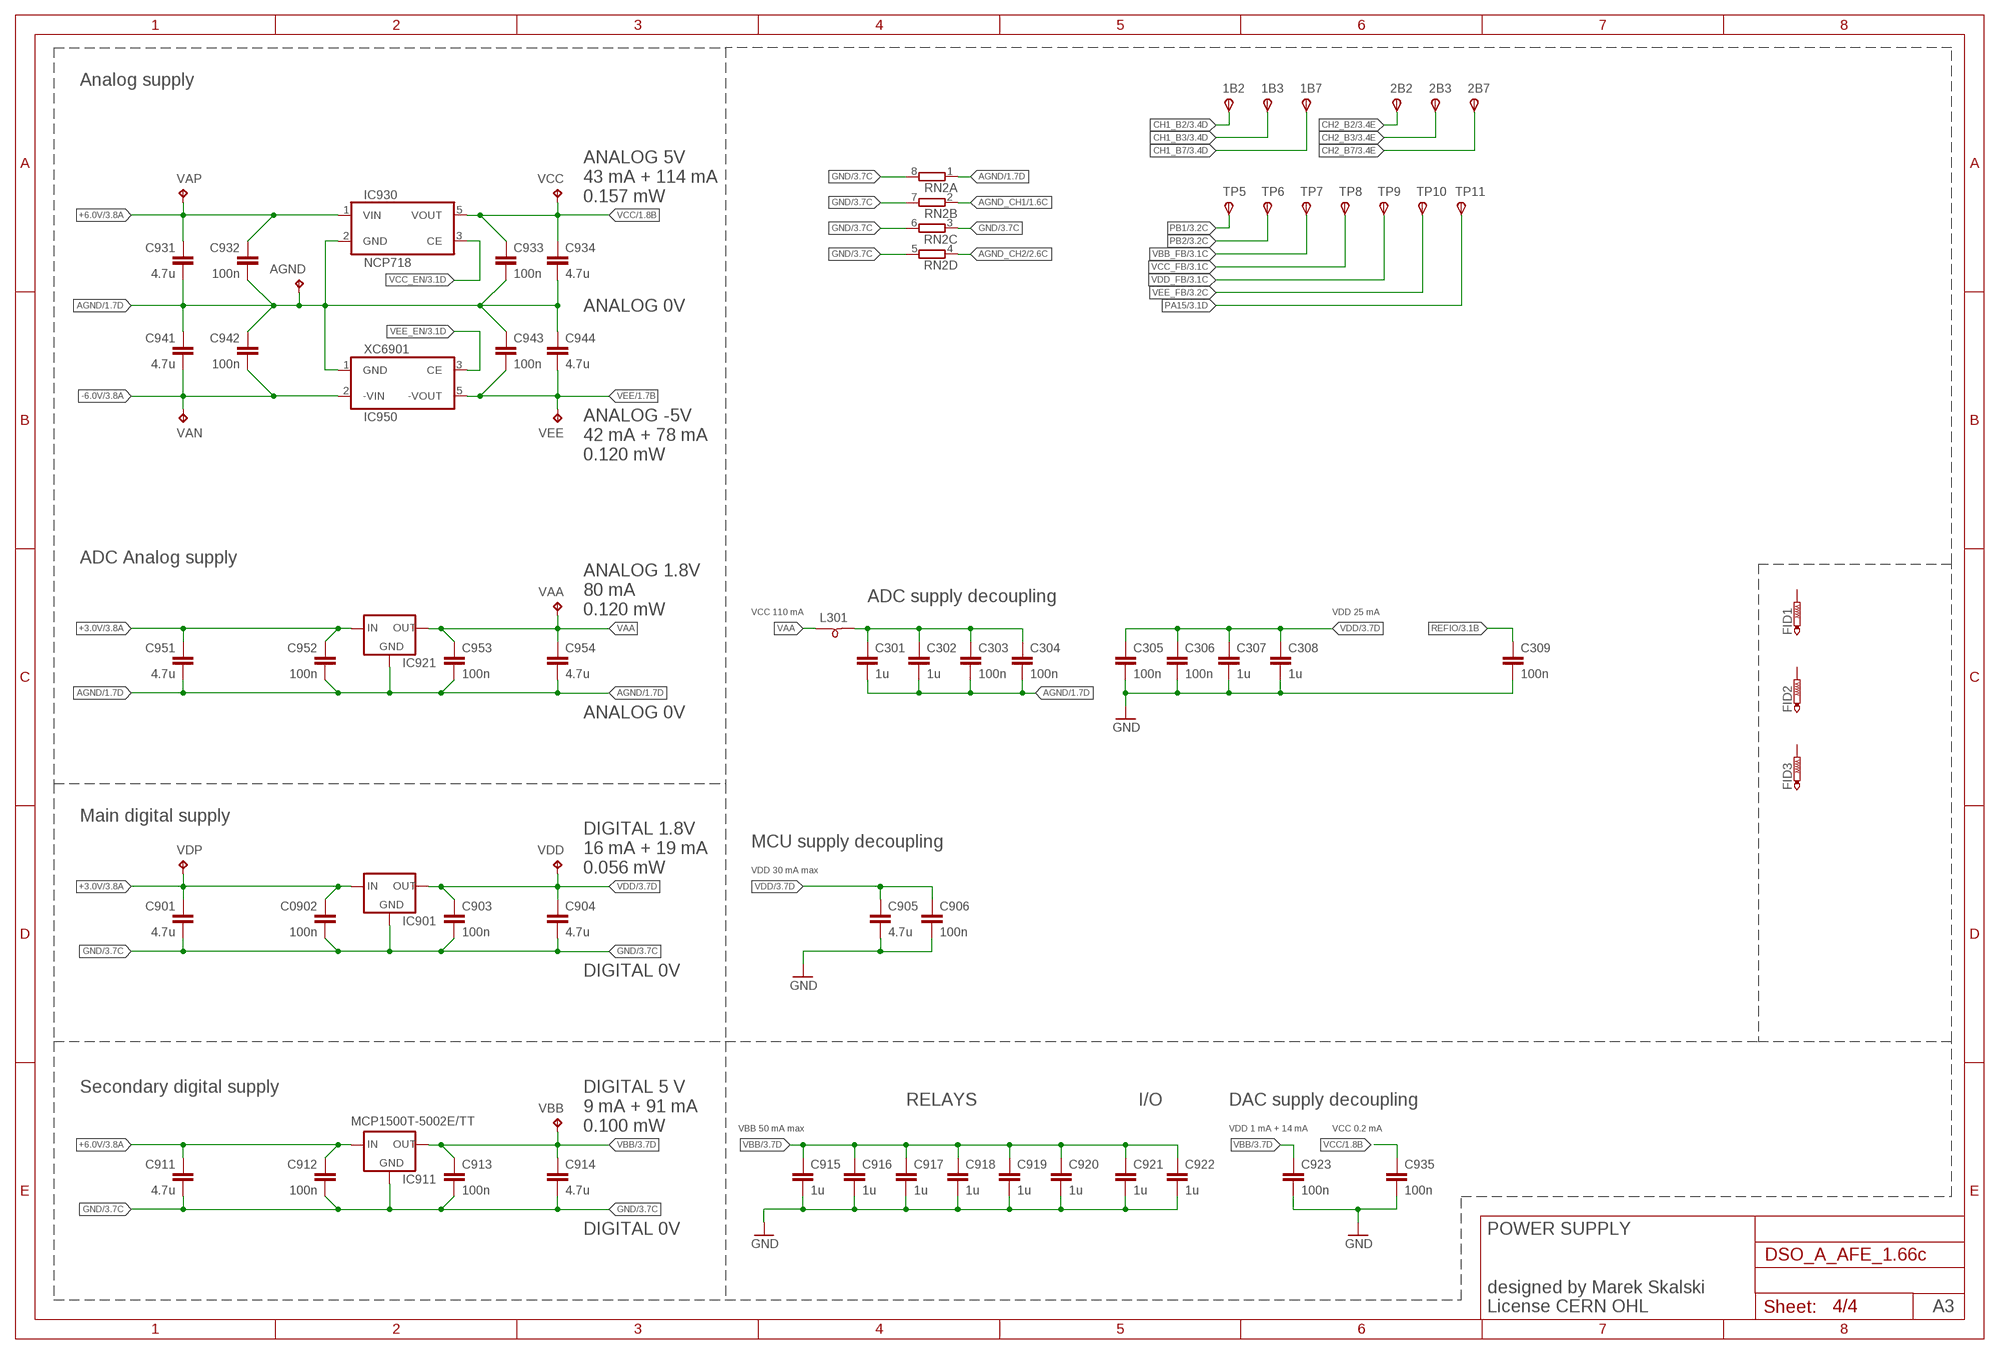
[diagram p3: schematic, sheet 4]

### Parts
1B2  TPSTP10R  [TP10R]
1B3  TPSTP10R  [TP10R]
1B7  TPSTP10R  [TP10R]
2B2  TPSTP10R  [TP10R]
2B3  TPSTP10R  [TP10R]
2B7  TPSTP10R  [TP10R]
AGND  TPB1,27  [B1,27]
C301  1u  C-EUC0603  [C0603]
C302  1u  C-EUC0603  [C0603]
C303  100n  C-EUC0603  [C0603]
C304  100n  C-EUC0603  [C0603]
C305  100n  C-EUC0603  [C0603]
C306  100n  C-EUC0603  [C0603]
C307  1u  C-EUC0603  [C0603]
C308  1u  C-EUC0603  [C0603]
C309  100n  C-EUC0603  [C0603]
C901  4.7u  C-EUC0603  [C0603]
C0902  100n  C-EUC0603  [C0603]
C903  100n  C-EUC0603  [C0603]
C904  4.7u  C-EUC0603  [C0603]
C905  4.7u  C-EUC0603  [C0603]
C906  100n  C-EUC0603  [C0603]
C911  4.7u  C-EUC0603  [C0603]
C912  100n  C-EUC0603  [C0603]
C913  100n  C-EUC0603  [C0603]
C914  4.7u  C-EUC0603  [C0603]
C915  1u  C-EUC0603  [C0603]
C916  1u  C-EUC0603  [C0603]
C917  1u  C-EUC0603  [C0603]
C918  1u  C-EUC0603  [C0603]
C919  1u  C-EUC0603  [C0603]
C920  1u  C-EUC0603  [C0603]
C921  1u  C-EUC0603  [C0603]
C922  1u  C-EUC0603  [C0603]
C923  100n  C-EUC0603  [C0603]
C931  4.7u  C-EUC0603  [C0603]
C932  100n  C-EUC0603  [C0603]
C933  100n  C-EUC0603  [C0603]
C934  4.7u  C-EUC0603  [C0603]
C935  100n  C-EUC0603  [C0603]
C941  4.7u  C-EUC0603  [C0603]
C942  100n  C-EUC0603  [C0603]
C943  100n  C-EUC0603  [C0603]
C944  4.7u  C-EUC0603  [C0603]
C951  4.7u  C-EUC0603  [C0603]
C952  100n  C-EUC0603  [C0603]
C953  100n  C-EUC0603  [C0603]
C954  4.7u  C-EUC0603  [C0603]
FID1  PTR1TP07SQ  [TP07SQ]
FID2  PTR1TP07SQ  [TP07SQ]
FID3  PTR1TP07SQ  [TP07SQ]
IC901  MCP1500  MCP1700TT  [SOT23]
IC911  MCP1500T-5002E/TT  MCP1700TT  [SOT23]
IC921  MCP1500  MCP1700TT  [SOT23]
IC930  NCP718  NCP718BSN  [SOT25]
IC950  XC6901  XC6901MR-G  [SOT25]
L301  SM-B0603  [0603]
RN2  4R-N0603-ARC  [0603-ARC]
TP5  TPSTP10R  [TP10R]
TP6  TPSTP10R  [TP10R]
TP7  TPSTP10R  [TP10R]
TP8  TPSTP10R  [TP10R]
TP9  TPSTP10R  [TP10R]
TP10  TPSTP10R  [TP10R]
TP11  TPSTP10R  [TP10R]
VAA  TPB1,27  [B1,27]
VAN  TPB1,27  [B1,27]
VAP  TPB1,27  [B1,27]
VBB  TPB1,27  [B1,27]
VCC  TPB1,27  [B1,27]
VDD  TPB1,27  [B1,27]
VDP  TPB1,27  [B1,27]
VEE  TPB1,27  [B1,27]

### Nets
+3.0V: C901.1 C0902.1 C951.1 C952.1 IC901.3(IN) IC921.3(IN) VDP.TP ; also sheet 3
+6.0V: C911.1 C912.1 C931.1 C932.1 IC911.3(IN) IC930.1(VIN) VAP.TP ; also sheet 3
-6.0V: C941.2 C942.2 IC950.2(-VIN) VAN.TP ; also sheet 3
AGND: AGND.TP C301.2 C302.2 C303.2 C304.2 C931.2 C932.2 C933.2 C934.2 C941.1 C942.1 C943.1 C944.1 C951.2 C952.2 C953.2 C954.2 IC921.1(GND) IC930.2(GND) IC950.1(GND) RN2.1 ; also sheet 1,2
AGND_CH1: RN2.2 ; also sheet 1
AGND_CH2: RN2.4 ; also sheet 2
CH1_B2: 1B2.TP(PP) ; also sheet 3
CH1_B3: 1B3.TP(PP) ; also sheet 3
CH1_B7: 1B7.TP(PP) ; also sheet 3
CH2_B2: 2B2.TP(PP) ; also sheet 3
CH2_B3: 2B3.TP(PP) ; also sheet 3
CH2_B7: 2B7.TP(PP) ; also sheet 3
GND: C305.2 C306.2 C307.2 C308.2 C309.2 C901.2 C0902.2 C903.2 C904.2 C905.2 C906.2 C911.2 C912.2 C913.2 C914.2 C915.2 C916.2 C917.2 C918.2 C919.2 C920.2 C921.2 C922.2 C923.2 C935.2 IC901.1(GND) IC911.1(GND) RN2.3 RN2.5 RN2.6 RN2.7 RN2.8 ; also sheet 3
PA15: TP11.TP(PP) ; also sheet 3
PB1: TP5.TP(PP) ; also sheet 3
PB2: TP6.TP(PP) ; also sheet 3
REFIO: C309.1 ; also sheet 3
VAA: C953.1 C954.1 IC921.2(OUT) L301.1 VAA.TP
VAA1: C301.1 C302.1 C303.1 C304.1 L301.2 ; also sheet 3
VBB: C913.1 C914.1 C915.1 C916.1 C917.1 C918.1 C919.1 C920.1 C921.1 C922.1 C923.1 IC911.2(OUT) VBB.TP ; also sheet 3
VBB_FB: TP7.TP(PP) ; also sheet 3
VCC: C933.1 C934.1 C935.1 IC930.5(VOUT) VCC.TP ; also sheet 1,2,3
VCC_EN: IC930.3(CE) ; also sheet 3
VCC_FB: TP8.TP(PP) ; also sheet 3
VDD: C305.1 C306.1 C307.1 C308.1 C903.1 C904.1 C905.1 C906.1 IC901.2(OUT) VDD.TP ; also sheet 3
VDD_FB: TP9.TP(PP) ; also sheet 3
VEE: C943.2 C944.2 IC950.5(-VOUT) VEE.TP ; also sheet 1,2
VEE_EN: IC950.3(CE) ; also sheet 3
VEE_FB: TP10.TP(PP) ; also sheet 3
Unconnected: FID1.TP FID2.TP FID3.TP

### Notes on the sheet
- Analog supply
- ANALOG 5V
  43 mA + 114 mA
  0.157 mW
- ANALOG 0V
- ANALOG -5V
  42 mA + 78 mA
  0.120 mW
- ADC Analog supply
- ADC supply decoupling
- ANALOG 1.8V
  80 mA
  0.120 mW
- VCC 110 mA | VDD 25 mA
- ANALOG 0V
- Main digital supply
- MCU supply decoupling
- DIGITAL 1.8V
  16 mA + 19 mA
  0.056 mW
- VDD 30 mA max
- DIGITAL 0V
- Secondary digital supply
- RELAYS | I/O | DAC supply decoupling
- DIGITAL 5 V
  9 mA + 91 mA
  0.100 mW
- VBB 50 mA max | VDD 1 mA + 14 mA | VCC 0.2 mA
- DIGITAL 0V
- POWER SUPPLY
  
  
  designed by Marek Skalski
  License CERN OHL
- A3

## Library data of the parts
1B2 1B3 1B7 2B2 2B3 2B7 TP5-TP11 = testpad:TPS: TEST PIN
#1+ #1- #1F #1I #1P #2+ #2- #2F #2I #2P AGND GND VAA VAN VAP VBB VCC VDD VDP VEE = testpad:TP: Test pad
C101 C103 C111 C113 C120 C130-C134 C140-C144 C151-C154 C160-C162 C171-C174 C181-C184 C191 C192 C195 C196 C201 C203 C211 C213 C220 C230-C234 C240-C244 C251-C254 C260-C262 C271-C274 C281-C284 C291 C292 C295 C296 C301-C309 C901 C0902 C903-C906 C911-C923 C931-C935 C941-C944 C951-C954 = rcl:C-EU: CAPACITOR, European symbol
C102 C112 C202 C212 = rcl:C-TRIMM: Trimm capacitor
FID1-FID3 = testpad:PTR1: TEST PIN
H810 H820 = led:CREE_PLCC4_RGB
IC2 IC4 = 40xx:DG4052: Vishay, Low Capacitance, Low Charge Injection, 4-Channel, ± 5 V / 12 V / 5 V / 3 V Analog Multiplexers
IC130 IC131 IC230 IC231 = analog-devices:AD8065: High Performance, 145 MHz FastFET Op Amps Source: http://www.analog.com/static/imported-files/data_sheets/AD8065_8066.pdf; MF: ALTERA CORPORATION; MPN: AD8065ARTZ-REEL7; OC_FARNELL: 1464845; OC_NEWARK: 59K6316
IC160 IC260 = analog-devices:AD8132: Analog Devices AD8132 Differential ADC driver
IC700 = maxim:MAX19516: MAXIM Dual-Channel, 10-Bit, 100Msps ADC
IC800 = stm32xx:STM32G031: STMicroelectronics ARM Cortex-M0+ MCU
IC810 IC820 = microchip:MCP23017: http://ww1.microchip.com/downloads/en/DeviceDoc/21952a.pdf Source: http://ww1.microchip.com/downloads/en/DeviceDoc/21952a.pdf; MF: MICROCHIP; MPN: MCP23017-E/ML; OC_FARNELL: unknown; OC_NEWARK: 31K2957
IC811-IC814 IC821-IC824 = special:L9110: Cheap H-Bridge available at AliExpress. 2.5-12 V, 800 mA
IC830 = microchip:MCP47CVBX2: Microchip Dual DAC 8/10/12-bit with (non)volatile memory and external voltage reference
IC901 IC911 IC921 = v-reg:MCP1700: Microchip Low Quiescent Current LDO, 250 mA
IC930 = v-reg:NCP718: ON Semiconductor Low Dropout Regulator, Wide Input Voltage, Low Iq, 300 mA
IC950 = v-reg:XC6901: TOREX 200mA Negative Voltage Regulator with ON/OFF Control
K100 K101 K111 K120 K200 K201 K211 K220 = relay:G6K: Low Signal Relay oeiwcsnts1.omron.com/.. D20G6K0100.pdf; MF: OMRON COMPONENTS USA; MPN: G6KU-2F-Y DC3; OC_FARNELL: unknown; OC_NEWARK: 89C6496
L171 L172 L181 L182 L271 L272 L281 L282 L301 = inductor-neosid:SM-B: INDUCTOR
R101-R103 R111-R113 R120 R129-R144 R151-R154 R161 R162 R201-R203 R211-R213 R220 R229-R244 R251-R254 R261 R262 R700 R810-R813 R820-R823 R841 R842 R851 R852 = rcl:R-EU_: RESISTOR, European symbol
RN2 RN5 RN11-RN14 = resistor-dil:4R-N: Array Chip Resistor Source: RS Component / Phycomp; OC_FARNELL: unknown; OC_NEWARK: unknown
X2 = pinhead:PINHD-1X5: PIN HEADER
X3 = con-samtec:QSE-040-02: 0,80mm HI-SPEED SOCKET QSE Serie Source: http://www.samtec.com/ftppub/cpdf/QSE-XXX-01-X-D-XX-FOOTPRINT.pdf http://www.samtec.com/ftppub/pdf/QSE.PDF; OC_FARNELL: unknown; OC_NEWARK: unknown
X101 X201 = con-coax:A1944-50: BNC CONNECTOR 50 Ohm; OC_FARNELL: unknown; OC_NEWARK: unknown